# Altium schematic sheet ELEC-DEM-555Timer.SchDoc
size A4
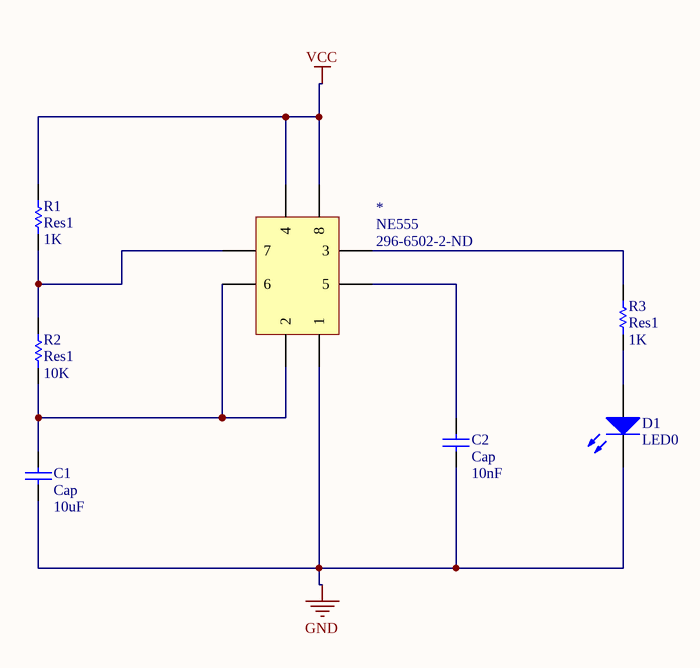
[diagram p0: ELEC-DEM-555Timer.SchDoc]

## Parts
*  NE555  Supplier Part Number 1: 296-6502-2-ND
C1  Cap  value 10uF  [RAD-0.3]
C2  Cap  value 10nF  [RAD-0.3]
D1  LED0  [LED-0]
R1  Res1  value 1K  [AXIAL-0.3]
R2  Res1  value 10K  [AXIAL-0.3]
R3  Res1  value 1K  [AXIAL-0.3]

## Nets
GND: *.?1(1) C1.1 C2.1 D1.2(K)
VCC: *.?5(4) *.?6(8) R1.2
Net*_?2: *.?2(2) *.?8(6) C1.2 R2.1
Net*_?3: *.?3(3) R3.2
Net*_?4: *.?4(5) C2.2
Net*_?7: *.?7(7) R1.1 R2.2
NetD1_1: D1.1(A) R3.1

## Library data of the parts
C1 C2 = Cap: Capacitor; Published: 8-Jun-2000; LatestRevisionDate: 17-Jul-2002; LatestRevisionNote: Re-released for DXP Platform.; PackageReference: RAD-0.3; Publisher: Altium Limited; PackageDescription: Radial Cap, Thru-Hole; 2 Leads; 0.3 in Pin Spacing
D1 = LED0: Typical INFRARED GaAs LED; Published: 8-Jun-2000; LatestRevisionDate: 08-Jul-2005; LatestRevisionNote: Mech Layer 1 removed.; PackageReference: LED-0; Publisher: Altium Limited; PackageDescription: LED; 2 Leads
R1-R3 = Res1: Resistor; Published: 8-Jun-2000; LatestRevisionDate: 17-Jul-2002; LatestRevisionNote: Re-released for DXP Platform.; PackageReference: AXIAL-0.3; Publisher: Altium Limited; PackageDescription: Axial Device, Thru-Hole; 2 Leads; 0.3 in Pin Spacing
* = NE555: Supplier 1: Digi-Key